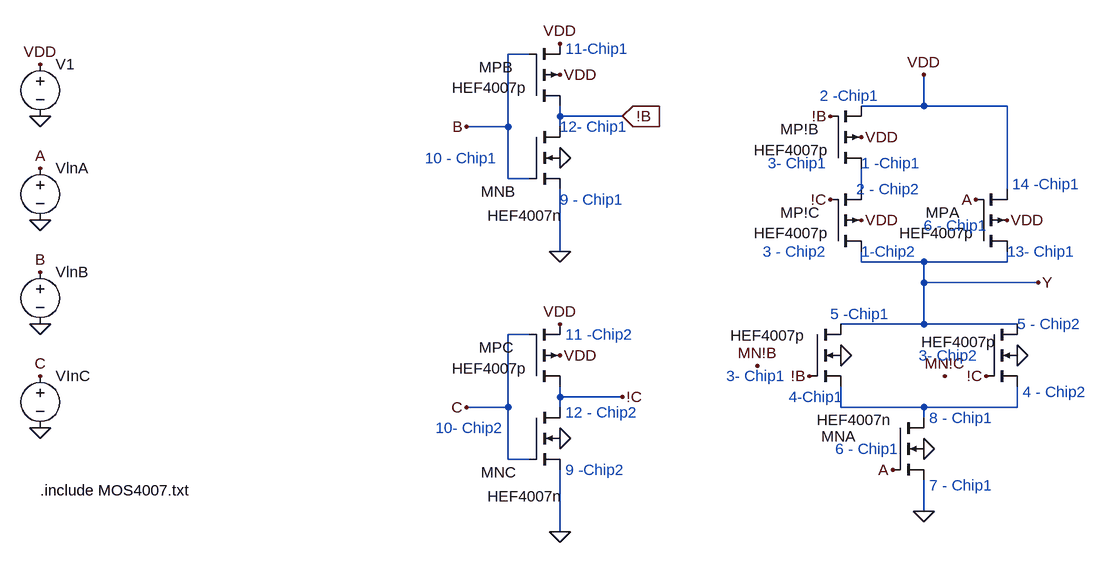
[diagram p0: schematic Gate-CMOS-esquema.asc]
Gate-CMOS-esquema.asc, the LTspice schematic file:
Version 4
SHEET 1 1912 1440
WIRE 176 144 144 144
WIRE 784 224 784 176
WIRE 784 224 688 224
WIRE 912 224 784 224
WIRE 224 240 224 224
WIRE 320 240 224 240
WIRE 144 256 144 144
WIRE 144 256 80 256
WIRE 224 256 224 240
WIRE 144 336 144 256
WIRE 176 336 144 336
WIRE 688 352 688 320
WIRE 912 352 912 224
WIRE 224 448 224 352
WIRE 688 464 688 448
WIRE 784 464 688 464
WIRE 912 464 912 448
WIRE 912 464 784 464
WIRE 784 496 784 464
WIRE 960 496 784 496
WIRE 784 560 784 496
WIRE 784 560 656 560
WIRE 928 560 784 560
WIRE 176 576 144 576
WIRE 224 672 224 656
WIRE 320 672 224 672
WIRE 144 688 144 576
WIRE 144 688 80 688
WIRE 224 688 224 672
WIRE 656 688 656 656
WIRE 784 688 656 688
WIRE 928 688 928 656
WIRE 928 688 784 688
WIRE 784 704 784 688
WIRE 144 768 144 688
WIRE 176 768 144 768
WIRE 784 848 784 800
WIRE 224 880 224 784
FLAG 80 256 B
FLAG 224 304 0
FLAG -576 240 0
FLAG 224 176 VDD
FLAG 224 448 0
FLAG -576 400 0
FLAG 224 128 VDD
FLAG 80 688 C
FLAG 224 736 0
FLAG 224 608 VDD
FLAG 224 880 0
FLAG 224 560 VDD
FLAG -576 560 0
FLAG -576 720 0
FLAG 320 240 !B
IOPIN 320 240 In
FLAG 320 672 !C
FLAG 784 176 VDD
FLAG 688 272 VDD
FLAG 912 400 VDD
FLAG 688 400 VDD
FLAG 640 240 !B
FLAG 960 496 Y
FLAG 656 608 0
FLAG 784 752 0
FLAG 928 608 0
FLAG 640 368 !C
FLAG 864 368 A
FLAG 816 640 MN!C
FLAG 528 624 MN!B
FLAG 736 784 A
FLAG 880 640 !C
FLAG 608 640 !B
FLAG 784 848 0
FLAG -576 320 A
FLAG -576 480 B
FLAG -576 640 C
FLAG -576 160 VDD
SYMBOL nmos4 176 256 R0
WINDOW 0 -74 100 Left 2
WINDOW 3 -64 137 Left 2
SYMATTR InstName MNB
SYMATTR Value HEF4007n
SYMBOL pmos4 176 224 M180
WINDOW 0 -77 60 Left 2
WINDOW 3 -118 28 Left 2
SYMATTR InstName MPB
SYMATTR Value HEF4007p
SYMBOL voltage -576 144 R0
WINDOW 123 0 0 Left 2
WINDOW 39 0 0 Left 2
SYMATTR InstName V1
SYMATTR Value ""
SYMBOL voltage -576 304 R0
WINDOW 123 0 0 Left 2
WINDOW 39 0 0 Left 2
SYMATTR InstName VlnA
SYMATTR Value ""
SYMBOL nmos4 176 688 R0
WINDOW 0 -74 100 Left 2
WINDOW 3 -64 137 Left 2
SYMATTR InstName MNC
SYMATTR Value HEF4007n
SYMBOL pmos4 176 656 M180
WINDOW 0 -77 60 Left 2
WINDOW 3 -118 28 Left 2
SYMATTR InstName MPC
SYMATTR Value HEF4007p
SYMBOL voltage -576 464 R0
WINDOW 123 0 0 Left 2
WINDOW 39 0 0 Left 2
SYMATTR InstName VlnB
SYMATTR Value ""
SYMBOL voltage -576 624 R0
WINDOW 123 0 0 Left 2
WINDOW 39 0 0 Left 2
SYMATTR InstName VInC
SYMATTR Value ""
SYMBOL nmos4 736 704 R0
WINDOW 0 -110 29 Left 2
WINDOW 3 -117 3 Left 2
SYMATTR InstName MNA
SYMATTR Value HEF4007n
SYMBOL nmos4 880 560 R0
WINDOW 0 56 32 Invisible 2
WINDOW 3 -100 27 Left 2
SYMATTR InstName MN4
SYMATTR Value HEF4007p
SYMBOL nmos4 608 560 R0
WINDOW 0 56 32 Invisible 2
WINDOW 3 -122 17 Left 2
SYMATTR InstName MN5
SYMATTR Value HEF4007p
SYMBOL pmos4 640 320 M180
WINDOW 0 -77 60 Left 2
WINDOW 3 -118 28 Left 2
SYMATTR InstName MP!B
SYMATTR Value HEF4007p
SYMBOL pmos4 640 448 M180
WINDOW 0 -77 60 Left 2
WINDOW 3 -118 28 Left 2
SYMATTR InstName MP!C
SYMATTR Value HEF4007p
SYMBOL pmos4 864 448 M180
WINDOW 0 -77 60 Left 2
WINDOW 3 -118 28 Left 2
SYMATTR InstName MPA
SYMATTR Value HEF4007p
TEXT -576 816 Left 2 !.include MOS4007.txt
TEXT 232 696 Left 2 ;12 - Chip2
TEXT 224 256 Left 2 ;12- Chip1
TEXT 16 304 Left 2 ;10 - Chip1
TEXT 32 720 Left 2 ;10- Chip2
TEXT 224 368 Left 2 ;9 - Chip1
TEXT 232 784 Left 2 ;9 -Chip2
TEXT 232 136 Left 2 ;11-Chip1
TEXT 232 576 Left 2 ;11 -Chip2
TEXT 784 408 Left 2 ;6 - Chip1
TEXT 912 448 Left 2 ;13- Chip1
TEXT 920 344 Left 2 ;14 -Chip1
TEXT 536 448 Left 2 ;3 - Chip2
TEXT 544 312 Left 2 ;3- Chip1
TEXT 624 208 Left 2 ;2 -Chip1
TEXT 688 312 Left 2 ;1 -Chip1
TEXT 680 352 Left 2 ;2 - Chip2
TEXT 688 448 Left 2 ;1-Chip2
TEXT 648 752 Left 2 ;6 - Chip1
TEXT 792 808 Left 2 ;7 - Chip1
TEXT 792 704 Left 2 ;8 - Chip1
TEXT 776 608 Left 2 ;3- Chip2
TEXT 928 560 Left 2 ;5 - Chip2
TEXT 936 664 Left 2 ;4 - Chip2
TEXT 480 640 Left 2 ;3- Chip1
TEXT 640 544 Left 2 ;5 -Chip1
TEXT 576 672 Left 2 ;4-Chip1

The netlist it stands for:
* Gate-CMOS-esquema.asc
MNB !B B 0 0 HEF4007n
MPB !B B VDD VDD HEF4007p
V1 VDD 0
VlnA A 0
MNC !C C 0 0 HEF4007n
MPC !C C VDD VDD HEF4007p
VlnB B 0
VInC C 0
MNA N002 A 0 0 HEF4007n
MN4 Y !C N002 0 HEF4007p
MN5 Y !B N002 0 HEF4007p
MP!B N001 !B VDD VDD HEF4007p
MP!C Y !C N001 VDD HEF4007p
MPA Y A VDD VDD HEF4007p
.model NMOS NMOS
.model PMOS PMOS
.lib standard.mos
.include MOS4007.txt
* 12 - Chip2
* 12- Chip1
* 10 - Chip1
* 10- Chip2
* 9 - Chip1
* 9 -Chip2
* 11-Chip1
* 11 -Chip2
* 6 - Chip1
* 13- Chip1
* 14 -Chip1
* 3 - Chip2
* 3- Chip1
* 2 -Chip1
* 1 -Chip1
* 2 - Chip2
* 1-Chip2
* 6 - Chip1
* 7 - Chip1
* 8 - Chip1
* 3- Chip2
* 5 - Chip2
* 4 - Chip2
* 3- Chip1
* 5 -Chip1
* 4-Chip1
.backanno
.end